# Altium schematic sheet VL53L0x.SchDoc
size B
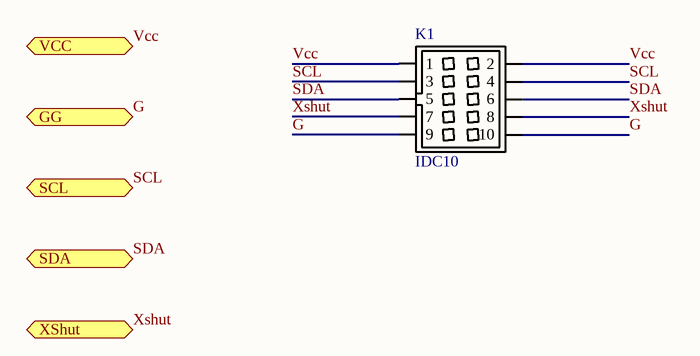
[diagram p0: VL53L0x.SchDoc]

## Parts
K1  IDC10  [IDC10-B]

## Ports
GG (bidir), SCL (bidir), SDA (bidir), VCC (bidir), XShut (bidir)

## Nets
G: K1.9 K1.10 ; port GG
SCL: K1.3 K1.4 ; port SCL
SDA: K1.5 K1.6 ; port SDA
Vcc: K1.1 K1.2 ; port VCC
Xshut: K1.7 K1.8 ; port XShut

## Library data of the parts
K1 = IDC10: BOXHEADER 10 PIN; Manufacturer: Assmann Electronics Inc; Manufacturer Part Number: AWHW10G-0202-T-R; Connector Type: Header, Shrouded; Number of Positions: 10; Number of Positions Loaded: All; Pitch: 0.100" (2.54mm); Supplier 1: Digi-Key; Supplier Part Number 1: HRP10H-ND; Supplier: Digi-Key; Contact Type: Male Pin; RoHS: RoHS Compliant; Supplier Part Number: HRP10H-ND; Category: Connectors, Interconnects; Number of Rows: 2; Row Spacing: 0.100" (2.54mm); Contact Mating Length: -; Mounting Type: Through Hole; Termination: Solder; Fastening Type: -; Features: -; Contact Finish: Gold; Contact Finish Thickness: Flash; Color: Gray; Packaging: Tray